# EAGLE design bebox_nidaq_2p (EAGLE 9.3.2)
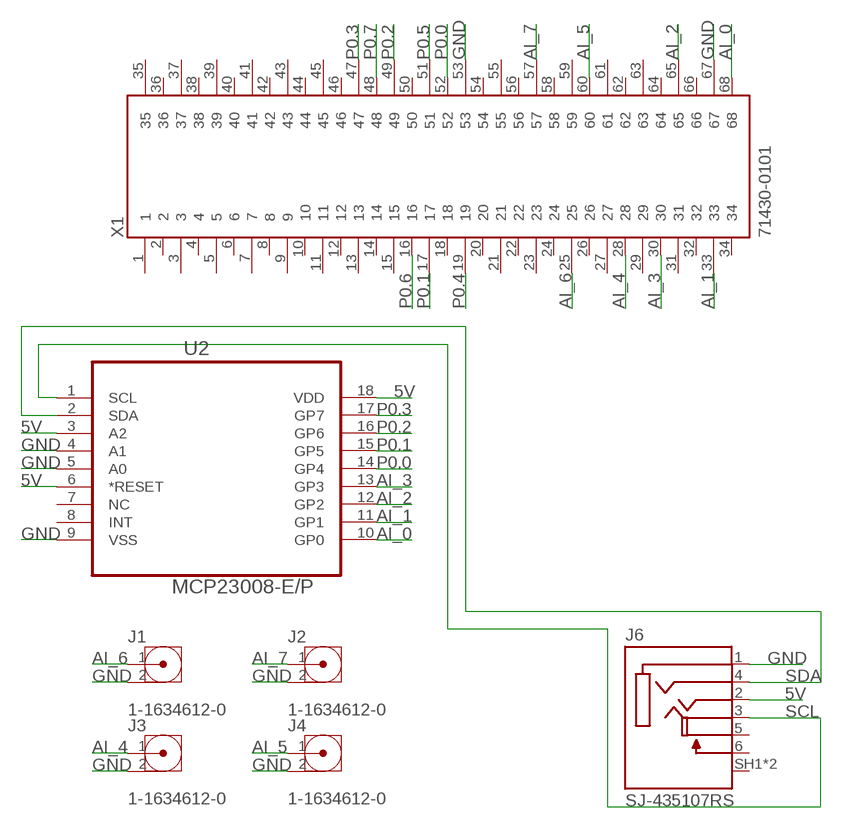
[diagram p0: schematic, sheet 1]

## Parts
J1  1-1634612-0  [TE_1-1634612-0]
J2  1-1634612-0  [TE_1-1634612-0]
J3  1-1634612-0  [TE_1-1634612-0]
J4  1-1634612-0  [TE_1-1634612-0]
J6  SJ-435107RS  [CUI_SJ-435107RS]
U2  MCP23008-E/P  [DIP254P762X533-18]
X1  71430-0101  [MOLEX_71430-0101]

## Nets
5V: J6.2(TIP) U2.3(A2) U2.6(*RESET) U2.18(VDD)
AI_0: U2.10(GP0) X1.68
AI_1: U2.11(GP1) X1.33
AI_2: U2.12(GP2) X1.65
AI_3: U2.13(GP3) X1.30
AI_4: J3.1 X1.28
AI_5: J4.1 X1.60
AI_6: J1.1 X1.25
AI_7: J2.1 X1.57
GND: J1.2 J2.2 J3.2 J4.2 J6.1(SLEEVE) U2.4(A1) U2.5(A0) U2.9(VSS) X1.53 X1.67
P0.0: U2.14(GP4) X1.52
P0.1: U2.15(GP5) X1.17
P0.2: U2.16(GP6) X1.49
P0.3: U2.17(GP7) X1.47
P0.4: X1.19
P0.5: X1.51
P0.6: X1.16
P0.7: X1.48
SCL: J6.3(RING1) U2.1(SCL)
SDA: J6.4(RING2) U2.2(SDA)
Unconnected: J6.5(ISOLATED_RING1) J6.6(ISOLATED_RING1_SWITCH(N-O)) J6.SH1(SHIELD) J6.SH2(SHIELD) U2.7(NC) U2.8(INT) X1.1 X1.2 X1.3 X1.4 X1.5 X1.6 X1.7 X1.8 X1.9 X1.10 X1.11 X1.12 X1.13 X1.14 X1.15 X1.18 X1.20 X1.21 X1.22 X1.23 X1.24 X1.26 X1.27 X1.29 X1.31 X1.32 X1.34 X1.35 X1.36 X1.37 X1.38 X1.39 X1.40 X1.41 X1.42 X1.43 X1.44 X1.45 X1.46 X1.50 X1.54 X1.55 X1.56 X1.58 X1.59 X1.61 X1.62 X1.63 X1.64 X1.66

## Library data of the parts
J1-J4 = 1-1634612-0:1-1634612-0: Conn ZDC/BNC RCP 0Hz to 4GHz 50Ohm Solder RA Thru-Hole Gold Over Nickel Over Copper Loose Piece; COMMENT: 1-1634612-0; DESCRIPTION: BNC Ins R/A PCB Skt 50Ohm Black; DIGI-KEY_PART_NUMBER: A97555-ND; DIGI-KEY_PURCHASE_URL: https://www.digikey.com/product-detail/en/te-connectivity-amp-connectors/1-1634612-0/A97555-ND/1755942?utm_source=snapeda&utm_medium=aggregator&utm_campaign=symbol; EU_ROHS_COMPLIANCE: Compliant; MF: TE Connectivity; MP: 1-1634612-0; NUMBER_OF_POSITIONS: 1; PACKAGE: None; TE_PURCHASE_URL: https://www.te.com/usa-en/product-1-1634612-0.html?te_bu=Cor&te_type=disp&te_campaign=seda_glo_cor-seda-global-disp-prtnr-fy19-seda-model-bom-cta_sma-317_1&elqCampaignId=32493
J6 = SJ-435107RS:SJ-435107RS: 3.5 mm Right Angle Shielded (0.141", 1/8", Mini Plug) Female HeadPhone Jack; AVAILABILITY: Good; DESCRIPTION: 3.5 mm Right Angle Shielded _0.141, 1/8, Mini Plug_ Female HeadPhone Jack; MF: CUI; MP: SJ-435107RS; PACKAGE: None; PRICE: 1.04 USD
U2 = MCP23008-E_P:MCP23008-E/P: IC I/O EXPANDER I2C 8B; AVAILABILITY: Unavailable; DESCRIPTION: MCP23008 Series 5.5 V 1.7 MHz 8-Bit I/O Expander with Serial Interface - PDIP-18; MF: Microchip; MP: MCP23008-E/P; PACKAGE: PDIP-18 Microchip; PRICE: None
X1 = 71430-0101:71430-0101: 0.80mm Pitch Ultra+™ VHDCI Receptacle, Right Angle, with or without Enhanced Shield, 68 Circuits; DESCRIPTION: 0.80mm Pitch Ultra+™ VHDCI Receptacle, Right Angle, with or without Enhanced Shield, 68 Circuits; DIGI-KEY_PART_NUMBER: WM7354-ND; DIGI-KEY_PURCHASE_URL: https://www.digikey.com/product-detail/en/molex/71430-0101/WM7354-ND/1998085?utm_source=snapeda&utm_medium=aggregator&utm_campaign=symbol; MF: Molex; MP: 71430-0101; PACKAGE: None

## Board
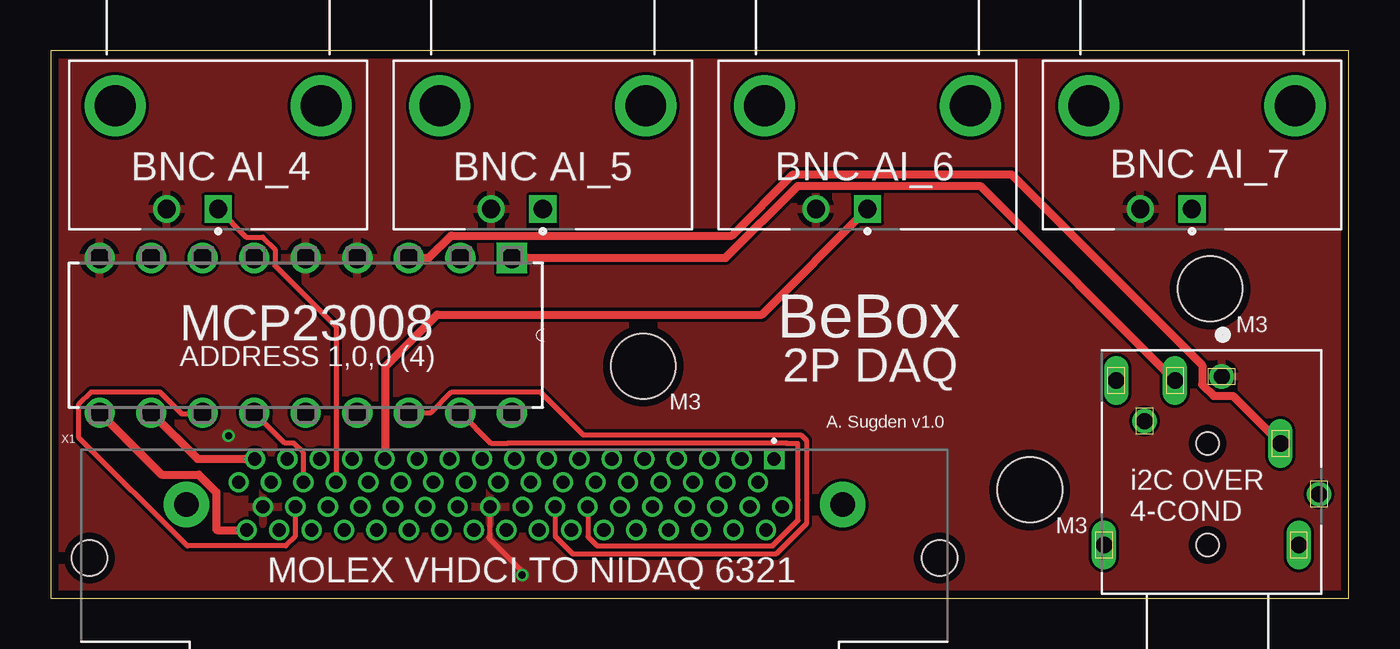
[diagram p1: board, top side]
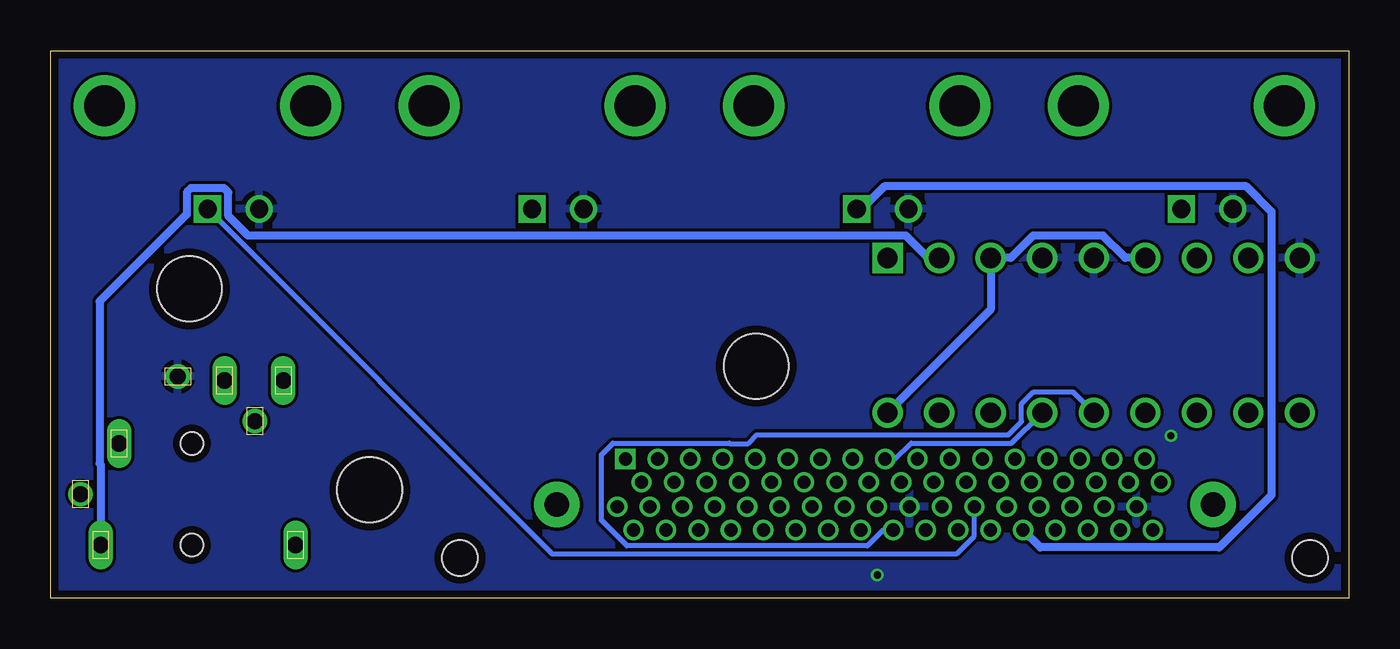
[diagram p2: board, bottom side, seen from below]

Size 63.99 x 26.98 mm. Coordinates in mm from the lower left corner, seen from the top.
Outline: 0,0 63.99,0 63.99,26.98 0,26.98 0,0
Copper layers (1*16): Top 0.035559375mm / dielectric 1.6mm / Bottom 0.035559375mm
Design rules "oshpark-2layer": minimum track width 6mil, minimum drill 10mil, track to track 6mil, track to pad 6mil, pad to pad 6mil, via to via 6mil, smd to smd 6mil, copper to edge 15mil, drill to drill 6mil, minimum pad ring 5mil, minimum via ring 5mil, stop-mask expansion 2.5mil, vias tented up to drill 0mil, thermal gap 10mil
Holes 3.2 mm at 57.15,15.24 48.26,5.33 29.21,11.43

### Footprints (pad centres in the part's own frame; a part is rotated, then mirrored left to right if it is on the bottom)
TE_1-1634612-0 = drill 0.89 square: 1 0,0 | drill 0.89: 2 0,2.54 | drill 2.01: S1 5.08,5.08; S2 5.08,-5.08
CUI_SJ-435107RS = drill 0.8 pad 1.1: 1 4.7,-0.7; 5 2.5,3.1; SH2 -1.1,-5.5 | drill 0.8 pad 1.1 long: 2 1.4,-3.6; 3 4.5,1.6; 4 -3.6,-4.5; 6 4.5,4.5; SH1 -3.6,5.1 | hole 1.1: -3.6,0; 1.4,0
DIP254P762X533-18 = drill 0.991 square: 1 -7.62,20.32 | drill 0.991: 2 -7.62,17.78; 3 -7.62,15.24; 4 -7.62,12.7; 5 -7.62,10.16; 6 -7.62,7.62; 7 -7.62,5.08; 8 -7.62,2.54; 9 -7.62,0; 10 0,0; 11 0,2.54; 12 0,5.08; 13 0,7.62; 14 0,10.16; 15 0,12.7; 16 0,15.24; 17 0,17.78; 18 0,20.32
MOLEX_71430-0101 = drill 0.65 pad 1 square: 1 12.8,0 | drill 0.65 pad 1: 2 12,-1.15; 3 11.2,0; 4 10.4,-1.15; 5 9.6,0; 6 8.8,-1.15; 7 8,0; 8 7.2,-1.15; 9 6.4,0; 10 5.6,-1.15; 11 4.8,0; 12 4,-1.15; 13 3.2,0; 14 2.4,-1.15; 15 1.6,0; 16 0.8,-1.15; 17 0,0; 18 -0.8,-1.15; 19 -1.6,0; 20 -2.4,-1.15; 21 -3.2,0; 22 -4,-1.15; 23 -4.8,0; 24 -5.6,-1.15; 25 -6.4,0; 26 -7.2,-1.15; 27 -8,0; 28 -8.8,-1.15; 29 -9.6,0; 30 -10.4,-1.15; 31 -11.2,0; 32 -12,-1.15; 33 -12.8,0; 34 -13.6,-1.15; 35 13.2,-2.35; 36 12.4,-3.5; 37 11.6,-2.35; 38 10.8,-3.5; 39 10,-2.35; 40 9.2,-3.5; 41 8.4,-2.35; 42 7.6,-3.5; 43 6.8,-2.35; 44 6,-3.5; 45 5.2,-2.35; 46 4.4,-3.5; 47 3.6,-2.35; 48 2.8,-3.5; 49 2,-2.35; 50 1.2,-3.5; 51 0.4,-2.35; 52 -0.4,-3.5; 53 -1.2,-2.35; 54 -2,-3.5; 55 -2.8,-2.35; 56 -3.6,-3.5; 57 -4.4,-2.35; 58 -5.2,-3.5; 59 -6,-2.35; 60 -6.8,-3.5; 61 -7.6,-2.35; 62 -8.4,-3.5; 63 -9.2,-2.35; 64 -10,-3.5; 65 -10.8,-2.35; 66 -11.6,-3.5; 67 -12.4,-2.35; 68 -13.2,-3.5 | drill 1.2 pad 2.25: 69 -16.175,-2.25; 70 16.175,-2.25 | hole 1.75: -20.95,-4.88; 20.95,-4.88

### Placement (x,y rotation side)
J1  40.26,19.18 90 top
J2  56.26,19.18 90 top
J3  8.26,19.18 90 top
J4  24.26,19.18 90 top
J6  57.02,6.22 90 top
U2  2.41,9.14 270 top
X1  22.86,6.86 0 top

### Tracks (layer width: path | path; a pad name or v marks a point on that pad's centre or on a via)
5V
  Top 0.406: U2.3 18.64,16.76 19.74,17.86 33.58,17.86 36.6,20.88 47.37,20.88 56.77,11.48 56.77,10.53 57.33,9.97 58.28,9.97 J6.2
  Bottom 0.406: U2.6 11.02,16.76 12.12,17.86 15.57,17.86 16.67,16.76 U2.3 17.65,14.22 U2.18
AI_0
  Top 0.406: X1.68 8.2,3.36 8.17,3.39 8.17,5.22 7.3,6.09 5.47,6.09 U2.10
AI_1
  Top 0.406: U2.11 7.24,6.86 X1.33
AI_2
  Top 0.254: U2.12 7.49,9.07 6.47,9.07 5.38,10.17 1.99,10.17 1.39,9.57 1.39,7.92 6.73,2.58 11.58,2.58 12.04,3.04 12.04,4.49 X1.65
AI_3
  Top 0.254: U2.13 11.54,7.64 11.98,7.64 12.46,7.16 X1.30
AI_4
  Top 0.254: X1.28 14.06,13.37 11.05,16.38 11.05,17.19 10.46,17.79 9.65,17.79 J3.1
AI_5
  Bottom 0.406: J4.1 24,19.18 22.86,20.32 5.08,20.32 3.81,19.05 3.81,5.08 6.39,2.5 15.2,2.5 X1.60
AI_6
  Top 0.406: X1.25 16.51,6.91 16.51,11.43 19.05,13.97 35.05,13.97 J1.1
AI_7
  Bottom 0.254: X1.57 18.48,4.49 18.48,3.04 19.34,2.17 39.26,2.17 J2.1
GND  (via drill 0.35)
  Top 0.254: X1.53 21.64,4.49 21.64,3.04 21.59,2.99 23.24,1.33 v23.24,1.14
  other vias: 8.76,8
  pour Top: -1.27,29.21 -1.27,-2.54 67.31,-2.54 67.31,29.21
  pour Bottom: -1.27,29.21 -1.27,-2.54 67.31,-2.54 67.31,29.21
P0.0
  Bottom 0.254: X1.52 22.96,3.36 23.74,2.58 35.58,2.58 36.84,3.83 36.84,7.07 36.28,7.64 30.54,7.64 30.52,7.62 29.6,7.62 29.18,8.04 16.79,8.04 16.14,8.7 16.14,9.57 15.54,10.17 14.69,10.17 14.68,10.16 13.59,10.16 U2.14
P0.1
  Bottom 0.254: U2.15 16.62,7.64 21.58,7.64 22.36,6.86 X1.17
P0.2
  Top 0.254: U2.16 18.75,9.14 19.77,10.17 24.12,10.17 26.25,8.04 36.98,8.04 37.25,7.78 37.25,3.67 35.75,2.17 25.74,2.17 24.88,3.04 24.88,4.49 X1.49
P0.3
  Top 0.254: X1.47 26.48,4.49 26.48,3.04 26.94,2.58 35.58,2.58 36.84,3.83 36.84,4.83 36.83,4.84 36.83,7.62 36.29,7.62 36.28,7.64 22.54,7.64 22.52,7.62 21.72,7.62 U2.17
SCL
  Top 0.406: U2.1 33.27,16.76 36.83,20.32 45.83,20.32 J6.3
SDA
  Bottom 0.406: U2.2 20.74,16.76 21.84,17.86 54.26,17.86 55.24,18.84 55.24,19.99 55.45,20.2 57.08,20.2 57.28,19.99 57.28,18.92 61.58,14.62 61.58,6.63 61.52,6.57 J6.4

### Text on the board
tPlace: BNC AI_4 | BNC AI_5 | BNC AI_6 | BNC AI_7 | MCP23008 | BeBox | M3 | ADDRESS 1,0,0 (4) | 2P DAQ | M3 | A. Sugden v1.0 | i2C OVER / 4-COND | M3 | MOLEX VHDCI TO NIDAQ 6321